# EAGLE design LPC800_TSSOP_breadboard_mini (EAGLE 6.5.0)
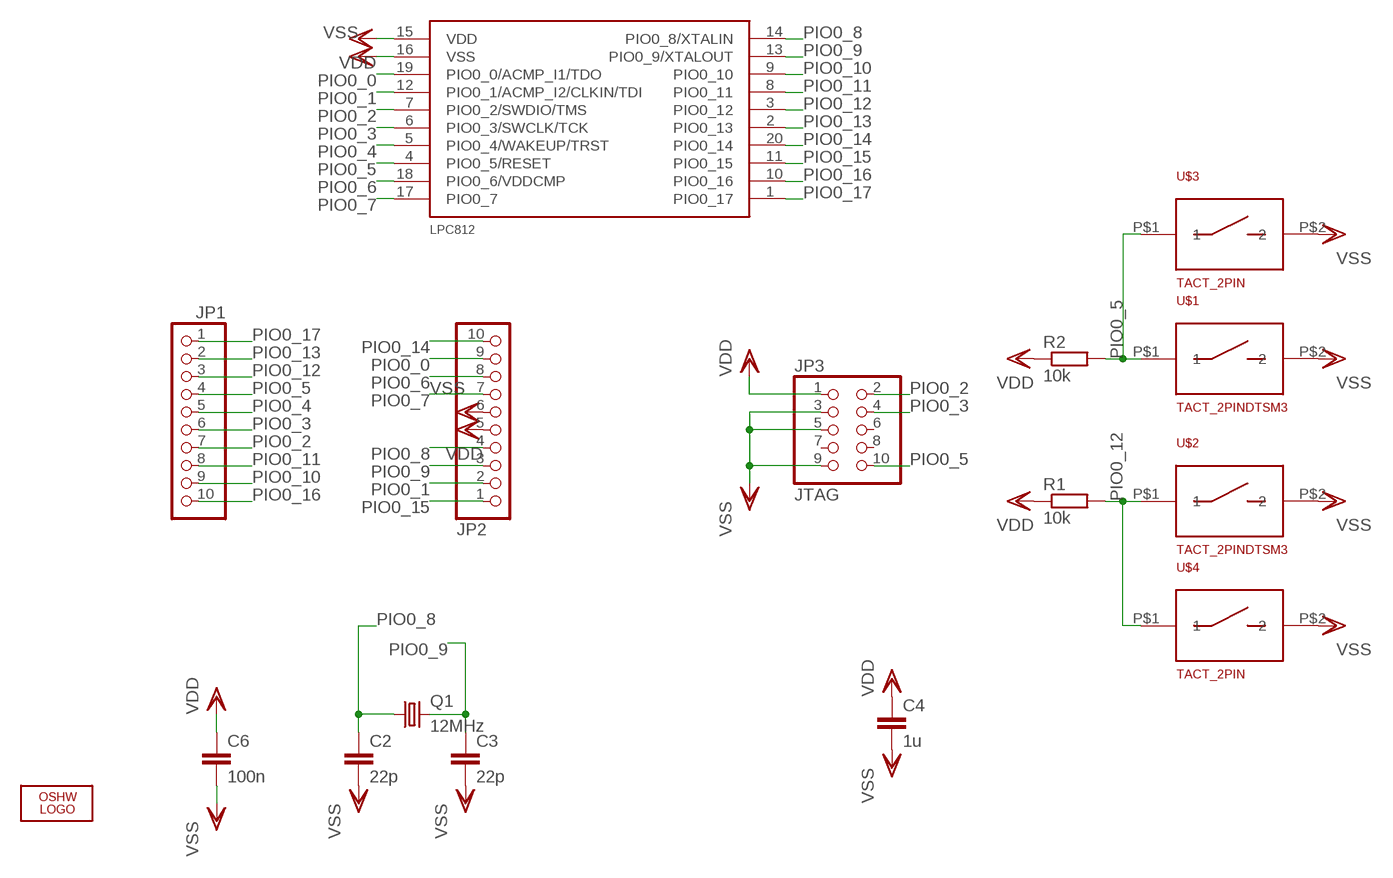
[diagram p0: schematic, sheet 1]

## Parts
C2  22p  C-EUC0603K  [C0603K]
C3  22p  C-EUC0603K  [C0603K]
C4  1u  C-EUC0805K  [C0805K]
C6  100n  C-EUC0603K  [C0603K]
JP1  PINHD-1X10NORM_OCT  [1X10_NORMAL_OCT]
JP2  PINHD-1X10NORM_OCT  [1X10_NORMAL_OCT]
JP3  JTAG  PINHD-2X5SMD_1.27_SMD  [2X05_1.27_SMD]
LOGO2  OSHW_LOGO_FILLX0150-NT  [OSHW_FILLX150_NOTEXT]
LPC812  LPC812M101JDH20  [TSSOP20]
Q1  12MHz  CRYSTALSMD_5.0X3.2  [CRYSTAL_5.0X3.2]
R1  10k  R-EU_R0603  [R0603]
R2  10k  R-EU_R0603  [R0603]
U$1  TACT_2PINDTSM3  [DTSM3]
U$2  TACT_2PINDTSM3  [DTSM3]
U$3  TACT_2PIN  [TD-85XU]
U$4  TACT_2PIN  [TD-85XU]

## Nets
PIO0_0: JP2.9 LPC812.19(PIO0_0/ACMP_I1/TDO)
PIO0_1: JP2.2 LPC812.12(PIO0_1/ACMP_I2/CLKIN/TDI)
PIO0_2: JP1.7 JP3.2 LPC812.7(PIO0_2/SWDIO/TMS)
PIO0_3: JP1.6 JP3.4 LPC812.6(PIO0_3/SWCLK/TCK)
PIO0_4: JP1.5 LPC812.5(PIO0_4/WAKEUP/TRST)
PIO0_5: JP1.4 JP3.10 LPC812.4(PIO0_5/RESET) R2.2 U$1.P$1 U$3.P$1
PIO0_6: JP2.8 LPC812.18(PIO0_6/VDDCMP)
PIO0_7: JP2.7 LPC812.17(PIO0_7)
PIO0_8: C2.1 JP2.4 LPC812.14(PIO0_8/XTALIN) Q1.1
PIO0_9: C3.1 JP2.3 LPC812.13(PIO0_9/XTALOUT) Q1.2
PIO0_10: JP1.9 LPC812.9(PIO0_10)
PIO0_11: JP1.8 LPC812.8(PIO0_11)
PIO0_12: JP1.3 LPC812.3(PIO0_12) R1.2 U$2.P$1 U$4.P$1
PIO0_13: JP1.2 LPC812.2(PIO0_13)
PIO0_14: JP2.10 LPC812.20(PIO0_14)
PIO0_15: JP2.1 LPC812.11(PIO0_15)
PIO0_16: JP1.10 LPC812.10(PIO0_16)
PIO0_17: JP1.1 LPC812.1(PIO0_17)
VDD: C4.1 C6.1 JP2.5 JP3.1 LPC812.15(VDD) R1.1 R2.1
VSS: C2.2 C3.2 C4.2 C6.2 JP2.6 JP3.3 JP3.5 JP3.9 LPC812.16(VSS) U$1.P$2 U$2.P$2 U$3.P$2 U$4.P$2
Unconnected: JP3.6 JP3.7 JP3.8

## Library data of the parts
C2 C3 C6 = SquantorRCL:C-EU: CAPACITOR, European symbol
C4 = bart_rcl:C-EU: CAPACITOR, European symbol
JP1 JP2 = SquantorConnectors:PINHD-1X10: PIN HEADER
JP3 = SquantorConnectors:PINHD-2X5: PIN HEADER
LOGO2 = ohw-logo:OSHW_LOGO_FILL
LPC812 = LPC800:LPC812M101JDH20
Q1 = bart_crystals:CRYSTAL: CRYSTAL
R1 R2 = bart_rcl:R-EU_: RESISTOR, European symbol
U$1-U$4 = SquantorButtons:TACT_2PIN

## Board
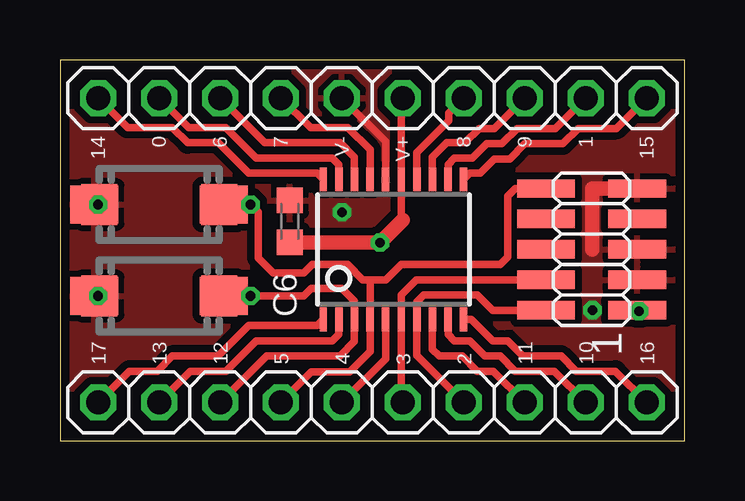
[diagram p1: board, top side]
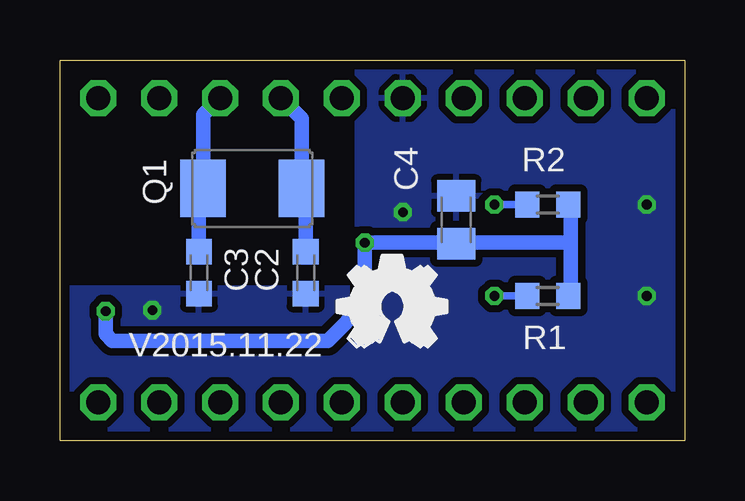
[diagram p2: board, bottom side, seen from below]

Size 26.04 x 15.88 mm. Coordinates in mm from the lower left corner, seen from the top.
Outline: 26.04,0 26.04,15.88 0,15.88 0,0 26.04,0
Copper layers (1*16): Top 0.0356mm / dielectric 1.5011mm / Bottom 0.0356mm
Design rules "OSHPark": minimum track width 6mil, minimum drill 13mil, track to track 6mil, track to pad 6mil, pad to pad 6mil, via to via 6mil, smd to smd 6mil, copper to edge 15mil, drill to drill 6mil, minimum pad ring 7mil, minimum via ring 7mil, stop-mask expansion 3mil, vias tented up to drill 0mil, thermal gap 10mil

### Footprints (pad centres in the part's own frame; a part is rotated, then mirrored left to right if it is on the bottom)
C0603K = smd 1.05 x 1.08: 1 -0.875,0; 2 0.875,0
C0805K = smd 1.3 x 1.6: 1 -1,0; 2 1,0
1X10_NORMAL_OCT = drill 1 octagon: 1 -11.43,0; 2 -8.89,0; 3 -6.35,0; 4 -3.81,0; 5 -1.27,0; 6 1.27,0; 7 3.81,0; 8 6.35,0; 9 8.89,0; 10 11.43,0
2X05_1.27_SMD = smd 0.76 x 2.4: 1 -2.54,-1.905; 2 -2.54,1.905; 3 -1.27,-1.905; 4 -1.27,1.905; 5 0,-1.905; 6 0,1.905; 7 1.27,-1.905; 8 1.27,1.905; 9 2.54,-1.905; 10 2.54,1.905
TSSOP20 = smd 0.305 x 0.991: 1 -2.925,-2.918; 2 -2.275,-2.918; 3 -1.625,-2.918; 4 -0.975,-2.918; 5 -0.325,-2.918; 6 0.325,-2.918; 7 0.975,-2.918; 8 1.625,-2.918; 9 2.275,-2.918; 10 2.925,-2.918; 11 2.925,2.918; 12 2.275,2.918; 13 1.625,2.918; 14 0.975,2.918; 15 0.325,2.918; 16 -0.325,2.918; 17 -0.975,2.918; 18 -1.625,2.918; 19 -2.275,2.918; 20 -2.925,2.918
CRYSTAL_5.0X3.2 = smd 1.9 x 2.4: 1 -2.05,0; 2 2.05,0
R0603 = smd 1 x 1.1: 1 -0.85,0; 2 0.85,0
DTSM3 = smd 2 x 1.6: P$1 -2.7,0; P$2 2.7,0
TD-85XU = smd 1.5 x 1.7: P$1 -2.5,0; P$2 2.5,0

### Placement (x,y rotation side)
C2  15.8,7 270 bottom
C3  20.24,7 270 bottom
C4  9.53,9.21 90 bottom
C6  9.58,9.14 90 top
JP1  13.02,1.59 0 top
JP2  13.02,14.29 180 top
JP3  22.15,7.98 90 top
LOGO1  OSHW_LOGO_FILLX0150-NT  [OSHW_FILLX150_NOTEXT]  14.16,3.91 0 bottom
LOGO2  14.48,3.91 0 bottom
LPC812  13.89,7.98 0 top
Q1  18.02,10.52 180 bottom
R1  5.71,6.03 180 bottom
R2  5.71,9.84 180 bottom
U$1  4.13,9.84 180 top
U$2  4.13,6.03 180 top
U$3  4.13,9.84 180 top
U$4  4.13,6.03 180 top

### Tracks (layer width: path | path; a pad name or v marks a point on that pad's centre or on a via)
PIO0_0
  Top 0.305: LPC812.19 11.62,11.52 11.35,11.79 8.18,11.79 6.91,13.06 5.36,13.06 JP2.9
PIO0_1
  Top 0.305: LPC812.12 16.17,11.52 16.43,11.79 17.18,11.79 17.78,12.38 18.41,12.38 19.05,13.02 20.64,13.02 JP2.2
PIO0_2
  Top 0.305: JP3.2 18.02,5.44 17.39,6.07 15.16,6.07 14.87,5.78 LPC812.7 14.87,3.55 JP1.7
PIO0_3
  Top 0.305: JP3.4 14.85,6.71 14.21,6.07 LPC812.6 14.22,1.66 JP1.6
PIO0_4
  Top 0.305: LPC812.5 13.57,3.41 JP1.5
PIO0_5  (via drill 0.4)
  Top 0.305: JP3.10 18.97,10.52 18.66,10.2 18.66,7.66 18.34,7.34 14.21,7.34 13.58,6.71 12.94,6.71 | 12.94,6.71 12.92,6.68 LPC812.4 12.92,3.71 12.06,2.86 10.48,2.86 JP1.4 | 12.94,6.71 12.62,6.71 11.99,7.34 10.52,7.34 10.16,6.99 8.89,6.99 8.26,7.62 8.26,9.53 v7.94,9.84 U$1.P$1
  Top 0.406: U$3.P$1 U$1.P$1
  Bottom 0.305: R2.2 v7.94,9.84
PIO0_6
  Top 0.305: LPC812.18 12.27,11.82 11.67,12.42 8.53,12.42 JP2.8
PIO0_7
  Top 0.305: LPC812.17 12.92,12.13 11.99,13.06 10.44,13.06 JP2.7
PIO0_8
  Top 0.305: LPC812.14 14.87,12.01 16.19,13.34 16.19,13.65 JP2.4
  Bottom 0.61: C2.1 15.8,10.98 Q1.1 15.97,13.43 JP2.4
PIO0_9
  Top 0.305: LPC812.13 15.52,11.82 16.12,12.42 16.87,12.42 17.46,13.02 18.1,13.02 JP2.3
  Bottom 0.61: C3.1 20.24,10.98 Q1.2 20.07,13.58 JP2.3
PIO0_10
  Top 0.305: LPC812.9 16.17,4.43 16.43,4.17 17.07,4.17 17.7,3.53 18.34,3.53 18.97,2.9 20.6,2.9 JP1.9
PIO0_11
  Top 0.305: LPC812.8 15.52,3.81 15.8,3.53 16.75,3.53 17.39,2.9 18.06,2.9 JP1.8
PIO0_12  (via drill 0.4)
  Top 0.305: JP1.3 8.61,3.53 11.67,3.53 12.27,4.13 LPC812.3 12.27,5.83 11.75,6.35 10.48,6.35 10.16,6.03 v7.94,6.03 U$2.P$1
  Top 0.406: U$4.P$1 U$2.P$1
  Bottom 0.305: R1.2 v7.94,6.03
PIO0_13
  Top 0.305: LPC812.2 11.62,4.43 11.35,4.17 8.18,4.17 6.91,2.9 5.44,2.9 JP1.2
PIO0_14
  Top 0.305: LPC812.20 10.72,11.15 7.86,11.15 6.59,12.42 5.32,12.42 4.69,13.06 2.82,13.06 JP2.10
PIO0_15
  Top 0.305: LPC812.11 17.07,11.15 17.5,11.15 18.1,11.75 18.73,11.75 19.37,12.38 20.95,12.38 21.59,13.02 23.18,13.02 JP2.1
PIO0_16
  Top 0.305: LPC812.10 17.13,5.06 18.02,4.17 18.66,4.17 19.29,3.53 20.88,3.53 21.51,2.9 23.14,2.9 JP1.10
PIO0_17
  Top 0.305: LPC812.1 10.72,4.8 7.86,4.8 6.59,3.53 4.69,3.53 4.05,2.9 2.9,2.9 JP1.1
VDD  (via drill 0.4)
  Top 0.305: LPC812.15 | LPC812.15 14.22,14.22 JP2.5 | LPC812.15 14.22,9.28 14.29,9.21
  Top 0.61: 14.29,9.21 v13.34,8.26 10.16,8.26 10.15,8.27 C6.1 | v24.13,5.4 24.09,5.4 JP3.1
  Bottom 0.61: 10.16,8.26 v13.34,8.26 13.34,5.71 14.88,4.17 23.85,4.17 24.13,4.45 v24.13,5.4 | 10.16,8.26 4.76,8.26 | 4.76,8.26 4.76,9.74 R2.1 | 4.76,8.26 4.76,6.13 R1.1 | C4.1 10.11,8.21 10.16,8.26
VSS  (via drill 0.4)
  Top 0.305: LPC812.16 13.57,12.47 JP2.6
  Top 0.61: JP3.9 22.19,10.52 22.19,7.98
  other vias: 22.19,5.44 11.75,9.53 1.59,9.84 1.59,6.03
  pour Top (isolate 0.305): 0,15.88 26.04,15.88 26.04,0 0,0
  pour Bottom (isolate 0.305): 0,15.88 13.65,15.88 13.65,6.35 26,6.35 26.04,0 0,0

### Text on the board
bPlace: V2015.11.22
tNames: 14 | 0 | 6 | 7 | V- | V+ | 8 | 9 | 1 | 15 | 17 | 13 | 12 | 5 | 4 | 3 | 2 | 11 | 10 | 16